# EAGLE schematic mainboard (EAGLE 4.13)
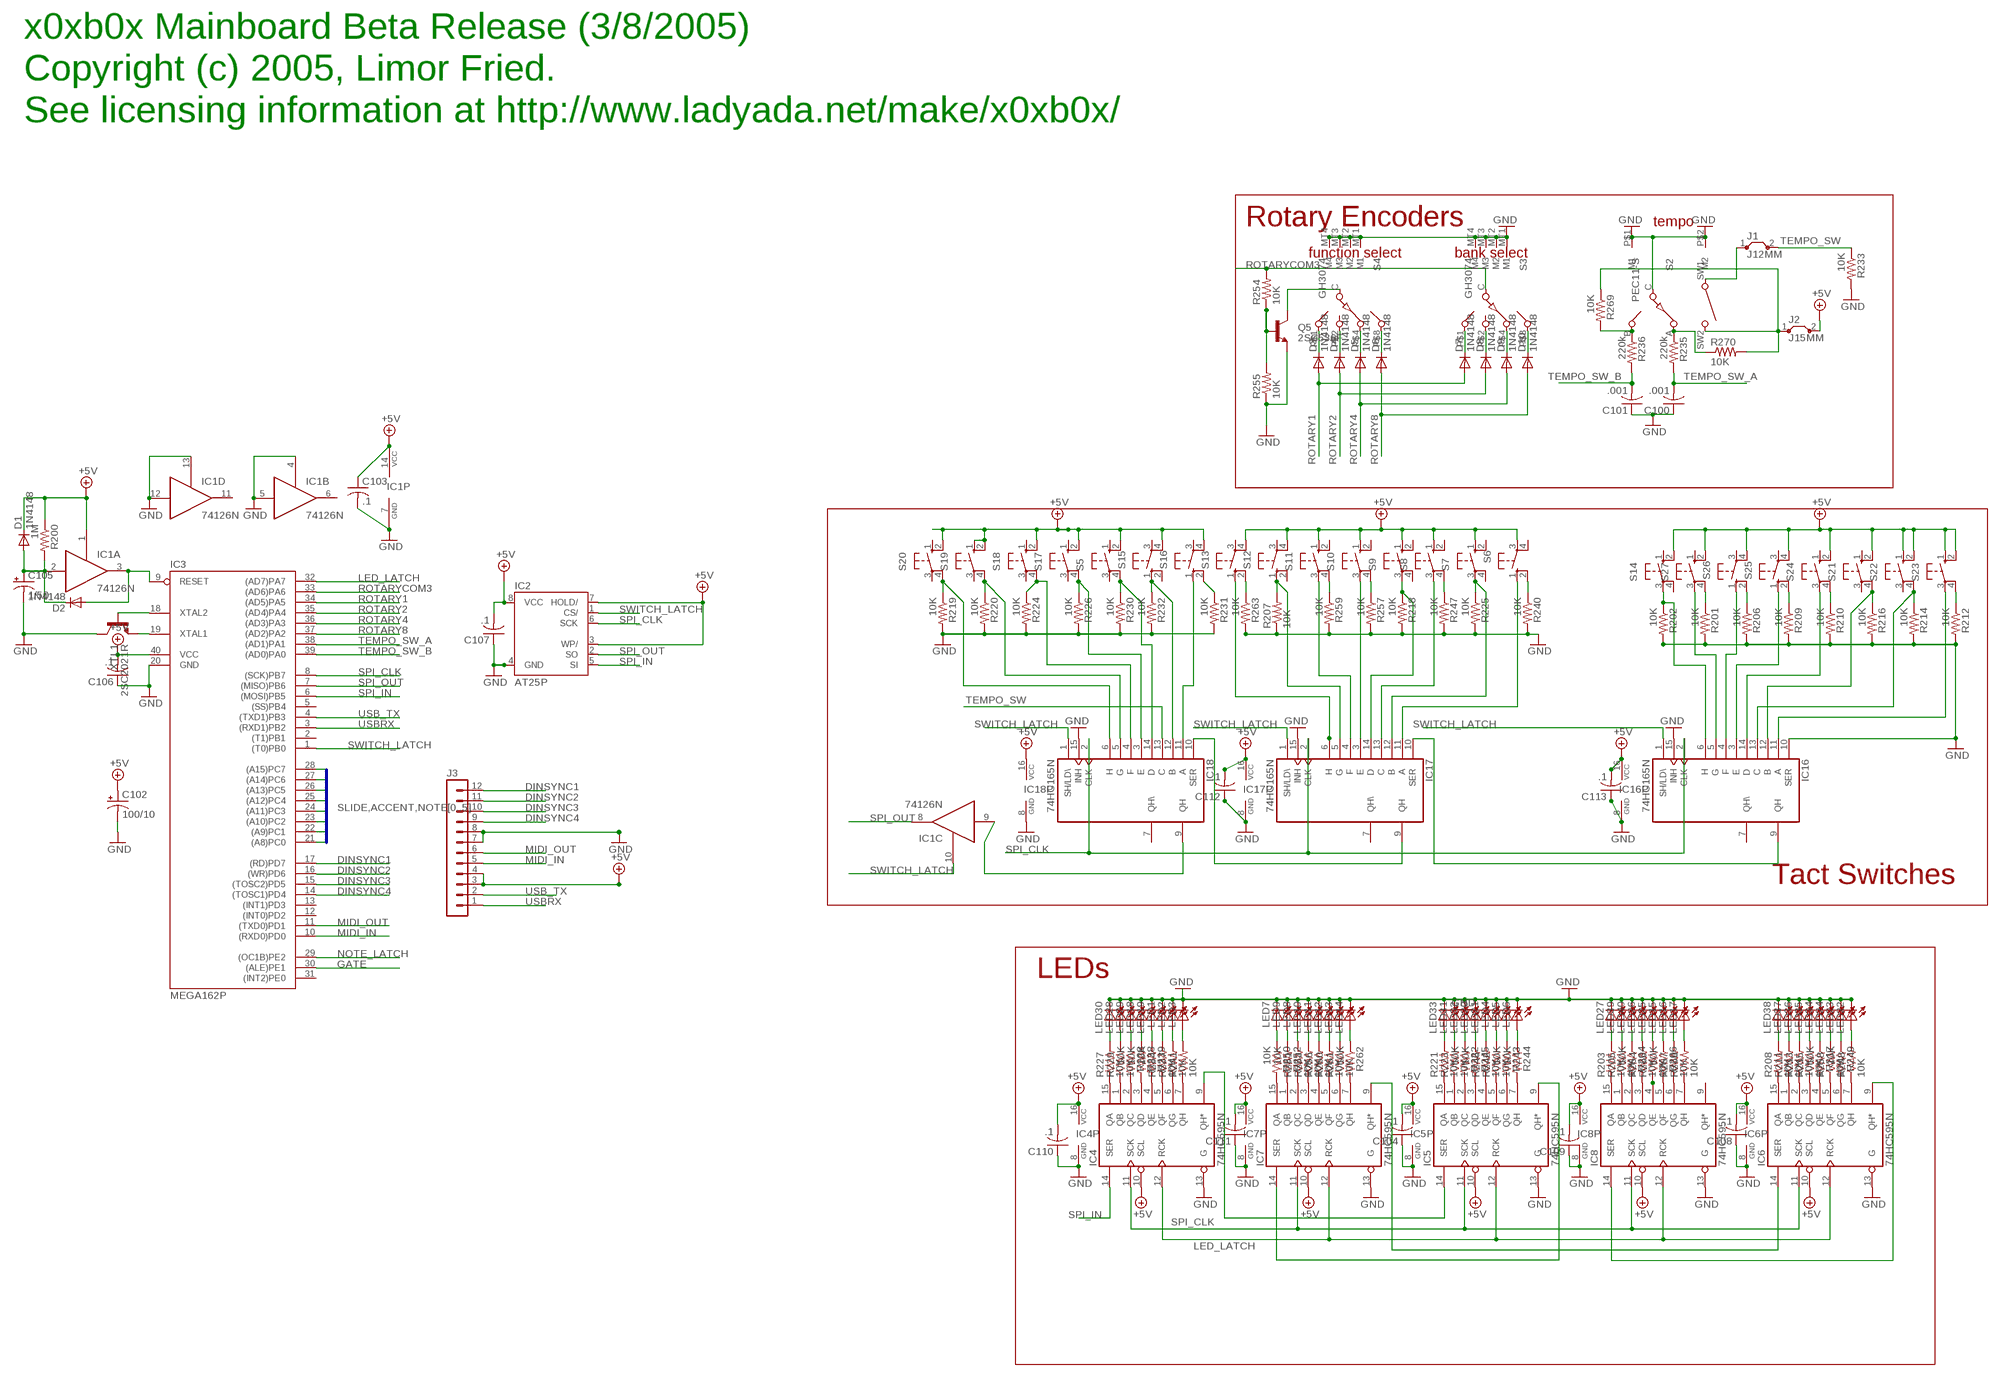
[diagram p0: schematic, sheet 1, part 1 of 2]
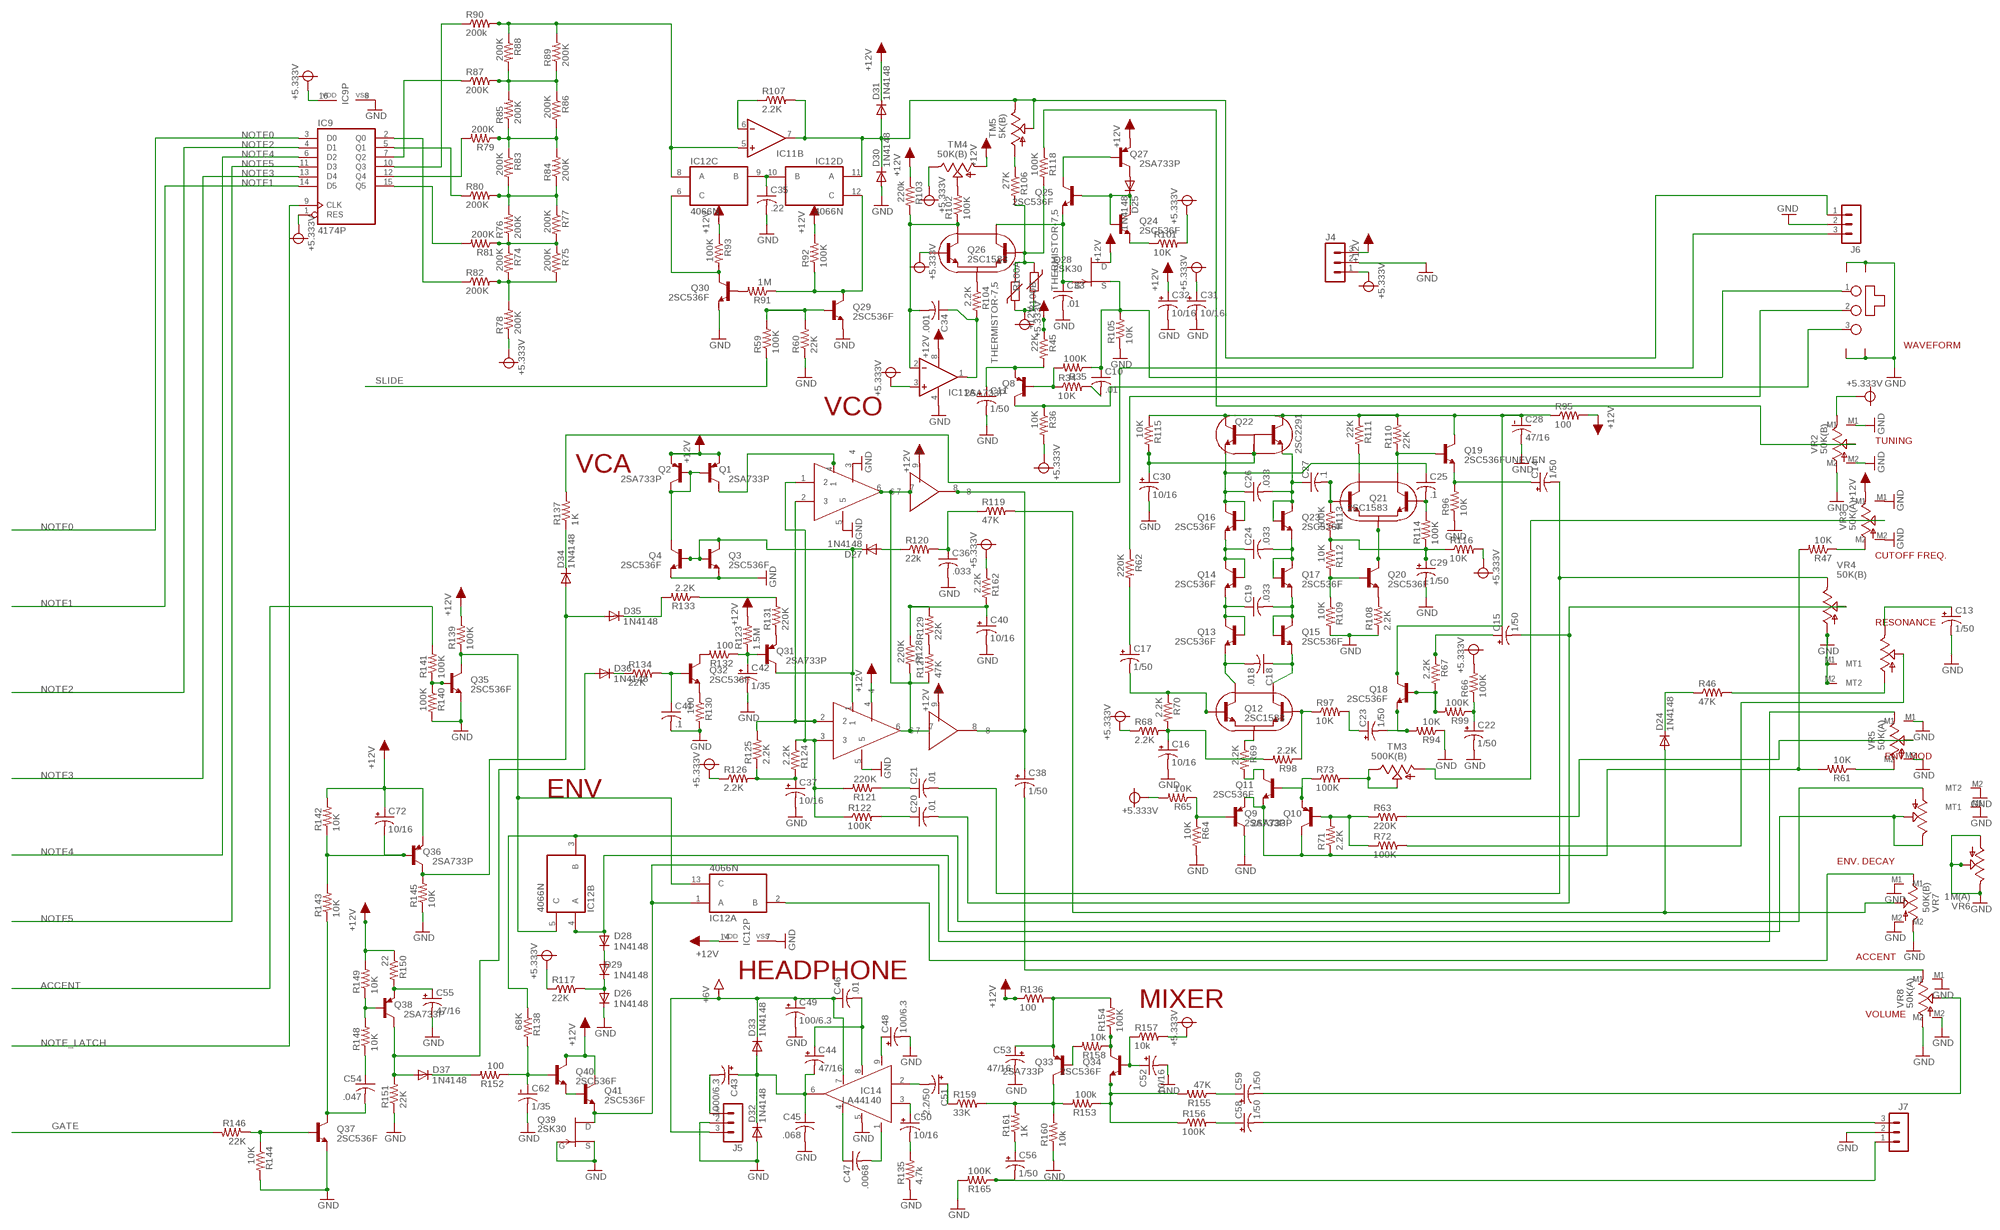
[diagram p1: schematic, sheet 1, part 2 of 2]

## Parts
C10  .01  C-US050-024X044  [C050-024X044]
C11  1/50  CPOL-USE5-6  [E5-6]
C13  1/50  CPOL-USE5-6  [E5-6]
C14  1/50  CPOL-USE5-6  [E5-6]
C15  1/50  CPOL-USE5-6  [E5-6]
C16  10/16  CPOL-USE5-6  [E5-6]
C17  1/50  CPOL-USE3.5-8  [E3,5-8]
C18  .018  C-US050-025X075  [C050-025X075]
C19  .033  C-US050-025X075  [C050-025X075]
C20  .01  C-US050-024X044  [C050-024X044]
C21  .01  C-US050-024X044  [C050-024X044]
C22  1/50  CPOL-USE5-6  [E5-6]
C23  1/50  CPOL-USE5-6  [E5-6]
C24  .033  C-US050-025X075  [C050-025X075]
C25  .1  C-US050-030X075  [C050-030X075]
C26  .033  C-US075-032X103  [C075-032X103]
C27  .1  C-US050-030X075  [C050-030X075]
C28  47/16  CPOL-USE5-6  [E5-6]
C29  1/50  CPOL-USE5-6  [E5-6]
C30  10/16  CPOL-USE5-6  [E5-6]
C31  10/16  CPOL-USE5-6  [E5-6]
C32  10/16  CPOL-USE5-6  [E5-6]
C33  .01  C-US050-024X044  [C050-024X044]
C34  .001  C-US050-035X075  [C050-035X075]
C35  .22  C-US050-045X075  [C050-045X075]
C36  .033  C-US050-025X075  [C050-025X075]
C37  10/16  CPOL-USE5-6  [E5-6]
C38  1/50  CPOL-USE5-6  [E5-6]
C40  10/16  CPOL-USE5-6  [E5-6]
C41  .1  C-US050-030X075  [C050-030X075]
C42  1/35  CPOL-USE2.5-7  [E2,5-7]
C43  1000/6.3  CPOL-USE5-5  [E5-5]
C44  47/16  CPOL-USE5-6  [E5-6]
C45  .068  C-US050-050X075  [C050-050X075]
C46  .01  C-US050-024X044  [C050-024X044]
C47  .0068  C-US050-075X075  [C050-075X075]
C48  100/6.3  CPOL-USE5-6  [E5-6]
C49  100/6.3  CPOL-USE5-6  [E5-6]
C50  10/16  CPOL-USE5-6  [E5-6]
C51  2.2/50  CPOL-USE5-6  [E5-6]
C52  10/16  CPOL-USE5-6  [E5-6]
C53  47/16  CPOL-USE5-6  [E5-6]
C54  .047  C-US050-055X075  [C050-055X075]
C55  47/16  CPOL-USE5-6  [E5-6]
C56  1/50  CPOL-USE5-6  [E5-6]
C58  1/50  CPOL-USE5-6  [E5-6]
C59  1/50  CPOL-USE5-6  [E5-6]
C62  1/35  CPOL-USE2.5-7  [E2,5-7]
C72  10/16  CPOL-USE5-6  [E5-6]
C100  .001  C-US050-035X075  [C050-035X075]
C101  .001  C-US050-035X075  [C050-035X075]
C102  100/10  CPOL-USE5-6  [E5-6]
C103  .1  C-US050H075X075  [C050H075X075]
C104  .1  C-US050H075X075  [C050H075X075]
C105  1/50  CPOL-USE5-6  [E5-6]
C106  .1  C-US050H075X075  [C050H075X075]
C107  .1  C-US050H075X075  [C050H075X075]
C108  .1  C-US050H075X075  [C050H075X075]
C109  .1  C-US050H075X075  [C050H075X075]
C110  .1  C-US050H075X075  [C050H075X075]
C111  .1  C-US050H075X075  [C050H075X075]
C112  .1  C-US050H075X075  [C050H075X075]
C113  .1  C-US050H075X075  [C050H075X075]
D1  1N4148  [DO35-10]
D2  1N4148  [DO35-10]
D3  1N4148  [DO35-10]
D4  1N4148  [DO35-10]
D5  1N4148  [DO35-10]
D6  1N4148  [DO35-10]
D7  1N4148  [DO35-10]
D8  1N4148  [DO35-10]
D9  1N4148  [DO35-10]
D10  1N4148  [DO35-10]
D24  1N4148  [DO35-10]
D25  1N4148  [DO35-10]
D26  1N4148  [DO35-10]
D27  1N4148  [DO35-10]
D28  1N4148  [DO35-10]
D29  1N4148  [DO35-10]
D30  1N4148  [DO35-10]
D31  1N4148  [DO35-10]
D32  1N4148  [DO35-10]
D33  1N4148  [DO35-10]
D34  1N4148  [DO35-10]
D35  1N4148  [DO35-10]
D36  1N4148  [DO35-10]
D37  1N4148  [DO35-10]
IC1  74126N  [DIL14]
IC2  AT25P  [DIL08]
IC3  MEGA162P  [DIL40]
IC4  74HC595N  [DIL16]
IC5  74HC595N  [DIL16]
IC6  74HC595N  [DIL16]
IC7  74HC595N  [DIL16]
IC8  74HC595N  [DIL16]
IC9  4174P  [DIL16]
IC11  AN6562N  [DIL08]
IC12  4066N  [DIL14]
IC14  LA44140  [SIP9]
IC15A  BA662  [SIP9]
IC15B  BA6110  [SIP9]
IC16  74HC165N  [DIL16]
IC17  74HC165N  [DIL16]
IC18  74HC165N  [DIL16]
J1  J12MM  [12]
J2  J15MM  [15]
J3  MA12-1  [MA12-1]
J4  MA03-1  [MA03-1]
J5  MA03-1  [MA03-1]
J6  MA03-1  [MA03-1]
J7  MA03-1  [MA03-1]
LED1  LED5MM  [LED5MM]
LED2  LED5MM  [LED5MM]
LED3  LED5MM  [LED5MM]
LED4  LED5MM  [LED5MM]
LED5  LED5MM  [LED5MM]
LED6  LED5MM  [LED5MM]
LED7  LED5MM  [LED5MM]
LED8  LED5MM  [LED5MM]
LED9  LED5MM  [LED5MM]
LED10  LED5MM  [LED5MM]
LED11  LED5MM  [LED5MM]
LED12  LED5MM  [LED5MM]
LED13  LED5MM  [LED5MM]
LED14  LED5MM  [LED5MM]
LED15  LED5MM  [LED5MM]
LED16  LED5MM  [LED5MM]
LED17  LED5MM  [LED5MM]
LED18  LED5MM  [LED5MM]
LED19  LED5MM  [LED5MM]
LED20  LED5MM  [LED5MM]
LED21  LED5MM  [LED5MM]
LED22  LED5MM  [LED5MM]
LED23  LED5MM  [LED5MM]
LED24  LED5MM  [LED5MM]
LED25  LED5MM  [LED5MM]
LED26  LED5MM  [LED5MM]
LED27  LED5MM  [LED5MM]
LED28  LED5MM  [LED5MM]
LED29  LED5MM  [LED5MM]
LED30  LED5MM  [LED5MM]
LED31  LED5MM  [LED5MM]
LED32  LED5MM  [LED5MM]
LED33  LED5MM  [LED5MM]
LED34  LED5MM  [LED5MM]
LED35  LED5MM  [LED5MM]
LED36  LED5MM  [LED5MM]
LED37  LED5MM  [LED5MM]
LED38  LED5MM  [LED5MM]
LED39  LED5MM  [LED5MM]
LED40  LED5MM  [LED5MM]
Q1  2SA733P  [TO92]
Q2  2SA733P  [TO92]
Q3  2SC536F  [2SC536F]
Q4  2SC536F  [2SC536F]
Q5  2SC536F  [2SC536F]
Q8  2SA733P  [TO92]
Q9  2SA733P  [TO92]
Q10  2SA733P  [TO92]
Q11  2SC536F  [2SC536F]
Q12  2SC1583  [SSIP5]
Q13  2SC536F  [2SC536F]
Q14  2SC536F  [2SC536F]
Q15  2SC536F  [2SC536F]
Q16  2SC536F  [2SC536F]
Q17  2SC536F  2SC536FUNEVEN  [2SC536_UNEVEN]
Q18  2SC536F  [2SC536F]
Q19  2SC536FUNEVEN  [2SC536_UNEVEN]
Q20  2SC536F  [2SC536F]
Q21  2SC1583  [SSIP5]
Q22  2SC2291  [SSIP5]
Q23  2SC536F  2SC536FUNEVEN  [2SC536_UNEVEN]
Q24  2SC536F  [2SC536F]
Q25  2SC536F  [2SC536F]
Q26  2SC1583  [SSIP5]
Q27  2SA733P  [TO92]
Q28  2SK30  [2SK30]
Q29  2SC536F  [2SC536F]
Q30  2SC536F  [2SC536F]
Q31  2SA733P  [TO92]
Q32  2SC536F  [2SC536F]
Q33  2SA733P  [TO92]
Q34  2SC536F  [2SC536F]
Q35  2SC536F  [2SC536F]
Q36  2SA733P  [TO92]
Q37  2SC536F  [2SC536F]
Q38  2SA733P  [TO92]
Q39  2SK30  [2SK30]
Q40  2SC536F  [2SC536F]
Q41  2SC536F  [2SC536F]
R34  10K  R-US_0207/5V  [0207/5V]
R35  100K  R-US_0207/5V  [0207/5V]
R36  10K  R-US_0207/5V  [0207/5V]
R45  22K  R-US_0207/5V  [0207/5V]
R46  47K  R-US_0207/5V  [0207/5V]
R47  10K  R-US_0207/5V  [0207/5V]
R59  100K  R-US_0207/5V  [0207/5V]
R60  22K  R-US_0207/5V  [0207/5V]
R61  10K  R-US_0207/5V  [0207/5V]
R62  220K  R-US_0207/5V  [0207/5V]
R63  220K  R-US_0207/5V  [0207/5V]
R64  10K  R-US_0207/5V  [0207/5V]
R65  10K  R-US_0207/5V  [0207/5V]
R66  100K  R-US_0207/5V  [0207/5V]
R67  2.2K  R-US_0207/5V  [0207/5V]
R68  2.2K  R-US_0207/5V  [0207/5V]
R69  2.2K  R-US_0207/5V  [0207/5V]
R70  2.2K  R-US_0207/5V  [0207/5V]
R71  2.2K  R-US_0207/5V  [0207/5V]
R72  100K  R-US_0207/5V  [0207/5V]
R73  100K  R-US_0207/5V  [0207/5V]
R74  200K  R-US_0207/5V  [0207/5V]
R75  200K  R-US_0207/5V  [0207/5V]
R76  200K  R-US_0207/5V  [0207/5V]
R77  200K  R-US_0207/5V  [0207/5V]
R78  200K  R-US_0207/5V  [0207/5V]
R79  200K  R-US_0207/5V  [0207/5V]
R80  200K  R-US_0207/5V  [0207/5V]
R81  200K  R-US_0207/5V  [0207/5V]
R82  200K  R-US_0207/5V  [0207/5V]
R83  200K  R-US_0207/5V  [0207/5V]
R84  200K  R-US_0207/5V  [0207/5V]
R85  200K  R-US_0207/5V  [0207/5V]
R86  200K  R-US_0207/5V  [0207/5V]
R87  200K  R-US_0207/5V  [0207/5V]
R88  200K  R-US_0207/5V  [0207/5V]
R89  200K  R-US_0207/5V  [0207/5V]
R90  200k  R-US_0207/5V  [0207/5V]
R91  1M  R-US_0207/5V  [0207/5V]
R92  100K  R-US_0207/5V  [0207/5V]
R93  100K  R-US_0207/5V  [0207/5V]
R94  10K  R-US_0207/5V  [0207/5V]
R95  100  R-US_0207/5V  [0207/5V]
R96  10K  R-US_0207/2V  [0207/2V]
R97  10K  R-US_0207/2V  [0207/2V]
R98  2.2K  R-US_0207/2V  [0207/2V]
R99  100K  R-US_0207/5V  [0207/5V]
R100A  THERMISTOR-7,5  [R-7,5]
R100B  THERMISTOR-7,5  [R-7,5]
R101  10K  R-US_0207/5V  [0207/5V]
R102  100K  R-US_0207/5V  [0207/5V]
R103  220k  R-US_0207/5V  [0207/5V]
R104  2.2K  R-US_0207/5V  [0207/5V]
R105  10K  R-US_0207/5V  [0207/5V]
R106  27K  R-US_0207/5V  [0207/5V]
R107  2.2K  R-US_0207/5V  [0207/5V]
R108  2.2K  R-US_0207/5V  [0207/5V]
R109  10K  R-US_0207/5V  [0207/5V]
R110  22K  R-US_0207/5V  [0207/5V]
R111  22K  R-US_0207/5V  [0207/5V]
R112  10K  R-US_0207/5V  [0207/5V]
R113  100K  R-US_0207/5V  [0207/5V]
R114  100K  R-US_0207/5V  [0207/5V]
R115  10K  R-US_0207/2V  [0207/2V]
R116  10K  R-US_0207/5V  [0207/5V]
R117  22K  R-US_0207/5V  [0207/5V]
R118  100K  R-US_0207/5V  [0207/5V]
R119  47K  R-US_0207/5V  [0207/5V]
R120  22k  R-US_0207/5V  [0207/5V]
R121  220K  R-US_0207/5V  [0207/5V]
R122  100K  R-US_0207/5V  [0207/5V]
R123  1.5M  R-US_0207/5V  [0207/5V]
R124  2.2K  R-US_0207/5V  [0207/5V]
R125  2.2K  R-US_0207/5V  [0207/5V]
R126  2.2K  R-US_0207/5V  [0207/5V]
R127  47K  R-US_0207/5V  [0207/5V]
R128  220K  R-US_0207/5V  [0207/5V]
R129  22K  R-US_0207/5V  [0207/5V]
R130  100  R-US_0207/5V  [0207/5V]
R131  220K  R-US_0207/5V  [0207/5V]
R132  100  R-US_0207/5V  [0207/5V]
R133  2.2K  R-US_0207/5V  [0207/5V]
R134  22K  R-US_0207/5V  [0207/5V]
R135  4.7k  R-US_0207/5V  [0207/5V]
R136  100  R-US_0207/5V  [0207/5V]
R137  1K  R-US_0207/10  [0207/10]
R138  68K  R-US_0207/5V  [0207/5V]
R139  100K  R-US_0207/5V  [0207/5V]
R140  100K  R-US_0207/5V  [0207/5V]
R141  100K  R-US_0207/5V  [0207/5V]
R142  10K  R-US_0207/5V  [0207/5V]
R143  10K  R-US_0207/5V  [0207/5V]
R144  10K  R-US_0207/5V  [0207/5V]
R145  10K  R-US_0207/5V  [0207/5V]
R146  22K  R-US_0207/5V  [0207/5V]
R148  10K  R-US_0207/5V  [0207/5V]
R149  10K  R-US_0207/5V  [0207/5V]
R150  22  R-US_0207/5V  [0207/5V]
R151  22K  R-US_0207/5V  [0207/5V]
R152  100  R-US_0207/5V  [0207/5V]
R153  100k  R-US_0207/5V  [0207/5V]
R154  100K  R-US_0207/5V  [0207/5V]
R155  47K  R-US_0207/5V  [0207/5V]
R156  100K  R-US_0207/5V  [0207/5V]
R157  10k  R-US_0207/5V  [0207/5V]
R158  10k  R-US_0207/5V  [0207/5V]
R159  33K  R-US_0207/5V  [0207/5V]
R160  10k  R-US_0207/5V  [0207/5V]
R161  1K  R-US_0207/5V  [0207/5V]
R162  2.2K  R-US_0207/5V  [0207/5V]
R165  100K  R-US_0207/5V  [0207/5V]
R200  1M  R-US_0207/5V  [0207/5V]
R201  10K  R-US_0207/5V  [0207/5V]
R202  10K  R-US_0207/5V  [0207/5V]
R203  10K  R-US_0207/5V  [0207/5V]
R204  10K  R-US_0207/5V  [0207/5V]
R205  10K  R-US_0207/5V  [0207/5V]
R206  10K  R-US_0207/5V  [0207/5V]
R207  10K  R-US_0207/5V  [0207/5V]
R208  10K  R-US_0207/5V  [0207/5V]
R209  10K  R-US_0207/5V  [0207/5V]
R210  10K  R-US_0207/5V  [0207/5V]
R211  10K  R-US_0207/5V  [0207/5V]
R212  10K  R-US_0207/5V  [0207/5V]
R213  10K  R-US_0207/5V  [0207/5V]
R214  10K  R-US_0207/5V  [0207/5V]
R215  10K  R-US_0207/5V  [0207/5V]
R216  10K  R-US_0207/5V  [0207/5V]
R217  10K  R-US_0207/5V  [0207/5V]
R218  10K  R-US_0207/5V  [0207/5V]
R219  10K  R-US_0207/5V  [0207/5V]
R220  10K  R-US_0207/5V  [0207/5V]
R221  10K  R-US_0207/5V  [0207/5V]
R222  10K  R-US_0207/5V  [0207/5V]
R223  10K  R-US_0207/5V  [0207/5V]
R224  10K  R-US_0207/5V  [0207/5V]
R225  10K  R-US_0207/5V  [0207/5V]
R226  10K  R-US_0207/5V  [0207/5V]
R227  10K  R-US_0207/5V  [0207/5V]
R228  10K  R-US_0207/5V  [0207/5V]
R229  10K  R-US_0207/5V  [0207/5V]
R230  10K  R-US_0207/5V  [0207/5V]
R231  10K  R-US_0207/5V  [0207/5V]
R232  10K  R-US_0207/10  [0207/10]
R233  10K  R-US_0207/5V  [0207/5V]
R234  10K  R-US_0207/15  [0207/15]
R235  220k  R-US_0207/5V  [0207/5V]
R236  220k  R-US_0207/5V  [0207/5V]
R237  10K  R-US_0207/5V  [0207/5V]
R238  10K  R-US_0207/5V  [0207/5V]
R239  10K  R-US_0207/5V  [0207/5V]
R240  10K  R-US_0207/5V  [0207/5V]
R241  10K  R-US_0207/5V  [0207/5V]
R242  10K  R-US_0207/5V  [0207/5V]
R243  10K  R-US_0207/5V  [0207/5V]
R244  10K  R-US_0207/5V  [0207/5V]
R245  10K  R-US_0207/5V  [0207/5V]
R246  10K  R-US_0207/5V  [0207/5V]
R247  10K  R-US_0207/5V  [0207/5V]
R248  10K  R-US_0207/5V  [0207/5V]
R249  10K  R-US_0207/5V  [0207/5V]
R250  10K  R-US_0207/5V  [0207/5V]
R251  10K  R-US_0207/5V  [0207/5V]
R252  10K  R-US_0207/5V  [0207/5V]
R253  10K  R-US_0207/5V  [0207/5V]
R254  10K  R-US_0207/5V  [0207/5V]
R255  10K  R-US_0207/5V  [0207/5V]
R256  10K  R-US_0207/5V  [0207/5V]
R257  10K  R-US_0207/5V  [0207/5V]
R258  10K  R-US_0207/5V  [0207/5V]
R259  10K  R-US_0207/5V  [0207/5V]
R260  10K  R-US_0207/5V  [0207/5V]
R261  10K  R-US_0207/5V  [0207/5V]
R262  10K  R-US_0207/5V  [0207/5V]
R263  10K  R-US_0207/5V  [0207/5V]
R264  10K  R-US_0207/5V  [0207/5V]
R265  10K  R-US_0207/5V  [0207/5V]
R266  10K  R-US_0207/5V  [0207/5V]
R267  10K  R-US_0207/5V  [0207/5V]
R268  10K  R-US_0207/5V  [0207/5V]
R269  10K  R-US_0207/5V  [0207/5V]
R270  10K  R-US_0207/5V  [0207/5V]
S1  SWITCH_GND  [NKKTOGGLE]
S2  PEC11-S  [PEC11-S]
S3  GH3074  [GH3074]
S4  GH3074  [GH3074]
S5  40-XX  [B3F-40XX]
S6  40-XX  [B3F-40XX]
S7  40-XX  [B3F-40XX]
S8  40-XX  [B3F-40XX]
S9  40-XX  [B3F-40XX]
S10  40-XX  [B3F-40XX]
S11  40-XX  [B3F-40XX]
S12  40-XX  [B3F-40XX]
S13  40-XX  [B3F-40XX]
S14  40-XX  [B3F-40XX]
S15  40-XX  [B3F-40XX]
S16  40-XX  [B3F-40XX]
S17  40-XX  [B3F-40XX]
S18  40-XX  [B3F-40XX]
S19  40-XX  [B3F-40XX]
S20  40-XX  [B3F-40XX]
S21  40-XX  [B3F-40XX]
S22  40-XX  [B3F-40XX]
S23  40-XX  [B3F-40XX]
S24  40-XX  [B3F-40XX]
S25  40-XX  [B3F-40XX]
S26  40-XX  [B3F-40XX]
S27  40-XX  [B3F-40XX]
TM3  500K(B)  TRIM_US-  [306]
TM4  50K(B)  TRIM_US-  [306]
TM5  5K(B)  TRIM_US-  [306]
VR2  50K(B)  POTEVU  [EVU]
VR3  50K(A)  POTEVU  [EVU]
VR4  50K(B)  DUALALPHA  [ALPHADUAL]
VR5  50K(A)  POTEVU  [EVU]
VR6  1M(A)  DUALALPHA  [ALPHADUAL]
VR7  50K(B)  POTEVU  [EVU]
VR8  50K(A)  POTEVU  [EVU]
XTL1  2SC2021R  [2SC2021]

## Nets
+5.333V: C31.+ IC9.1(RES) IC9.16(VDD) IC11.3(A:+IN) J4.1 Q26.1(B) R36.2 R65.2 R66.2 R68.1 R78.1 R100A.2 R100B.1 R101.2 R116.2 R117.1 R126.1 R157.2 R162.1 TM4.3(E) VR2.3(E)
+5V: C102.+ C103.1 C104.2 C106.2 C107.2 C108.2 C109.2 C110.2 C111.2 C112.2 C113.2 D1.C IC1.1(A:OE) IC1.14(P:VCC) IC2.3(WP/) IC2.7(HOLD/) IC2.8(VCC) IC3.40(VCC) IC4.10(SCL) IC4.16(VCC) IC5.10(SCL) IC5.16(VCC) IC6.10(SCL) IC6.16(VCC) IC7.10(SCL) IC7.16(VCC) IC8.10(SCL) IC8.16(VCC) IC16.16(VCC) IC17.16(VCC) IC18.16(VCC) J2.2 J3.3 J3.4 R200.1 S5.2(S1) S6.3(P) S7.1(S) S8.1(S) S9.1(S) S10.1(S) S11.1(S) S12.4(P1) S13.4(P1) S14.2(S1) S15.4(P1) S16.4(P1) S17.2(S1) S18.2(S1) S19.1(S) S19.2(S1) S20.2(S1) S21.2(S1) S22.1(S) S22.2(S1) S23.1(S) S23.2(S1) S24.2(S1) S25.4(P1) S26.4(P1) S27.2(S1)
+6V: C46.1 C49.+ D33.C IC14.7 J5.3
+12V: C32.+ C72.+ D31.C IC11.8(P:V+) IC12.14(P:VDD) IC15A.4 IC15A.9 IC15B.9 J4.3 Q1.3(E) Q2.3(E) Q27.3(E) Q28.1(D) Q36.3(E) Q40.2(C) Q41.2(C) R45.1 R92.2 R93.1 R95.2 R103.1 R123.2 R136.1 R139.2 R142.2 R149.2 R150.1 TM4.1(A) VR3.3(E)
ACCENT: IC3.28((A15)PC7) R141.2
C48: C48.+ IC14.9
DINSYNC1: IC3.17((RD)PD7) J3.12
DINSYNC2: IC3.16((WR)PD6) J3.11
DINSYNC3: IC3.15((TOSC2)PD5) J3.10
DINSYNC4: IC3.14((TOSC1)PD4) J3.9
GATE: IC3.30((ALE)PE1) R146.2
GND: C11.- C13.- C16.- C22.- C28.- C29.- C30.- C31.- C32.- C33.2 C35.2 C36.2 C37.- C40.- C41.2 C42.- C45.2 C48.- C49.- C52.- C53.- C55.- C62.- C100.1 C101.1 C102.- C103.2 C104.1 C105.- C106.1 C107.1 C108.1 C109.1 C110.1 C111.1 C112.1 C113.1 D26.C D30.A D32.A IC1.4(B:OE) IC1.5(B:I) IC1.7(P:GND) IC1.12(D:I) IC1.13(D:OE) IC2.4(GND) IC3.20(GND) IC4.8(GND) IC4.13(G) IC5.8(GND) IC5.13(G) IC6.8(GND) IC6.13(G) IC7.8(GND) IC7.13(G) IC8.8(GND) IC8.13(G) IC9.8(VSS) IC11.4(P:V-) IC12.7(P:VSS) IC14.5 IC15A.5 IC15B.3 IC15B.5 IC16.8(GND) IC16.10(SER) IC16.15(INH) IC17.8(GND) IC17.15(INH) IC18.8(GND) IC18.15(INH) J3.7 J3.8 J4.2 J5.2 J6.2 J7.2 LED1.K(C) LED2.K(C) LED3.K(C) LED4.K(C) LED5.K(C) LED6.K(C) LED7.K(C) LED8.K(C) LED9.K(C) LED10.K(C) LED11.K(C) LED12.K(C) LED13.K(C) LED14.K(C) LED15.K(C) LED16.K(C) LED17.K(C) LED18.K(C) LED19.K(C) LED20.K(C) LED21.K(C) LED22.K(C) LED23.K(C) LED24.K(C) LED25.K(C) LED26.K(C) LED27.K(C) LED28.K(C) LED29.K(C) LED30.K(C) LED31.K(C) LED32.K(C) LED33.K(C) LED34.K(C) LED35.K(C) LED36.K(C) LED37.K(C) LED38.K(C) LED39.K(C) LED40.K(C) Q3.3(E) Q4.3(E) Q5.3(E) Q9.2(C) Q29.3(E) Q30.3(E) Q35.3(E) Q37.3(E) Q39.2(G) Q39.3(S) R60.1 R64.2 R94.1 R96.1 R105.1 R108.1 R109.2 R130.2 R135.1 R140.2 R144.2 R145.1 R151.1 R160.1 R165.2 R201.2 R202.2 R206.2 R207.1 R209.2 R210.2 R212.2 R214.2 R216.2 R218.2 R219.2 R220.2 R224.2 R225.2 R226.2 R230.2 R231.2 R232.2 R233.2 R240.2 R247.2 R255.1 R257.2 R259.2 R263.2 S1.M1 S1.M2 S1.M3 S1.M4 S2.C S2.P$1(M1) S2.P$2(M2) S3.MT1(M1) S3.MT2(M2) S3.MT3(M3) S3.MT4(M4) S4.MT1(M1) S4.MT2(M2) S4.MT3(M3) S4.MT4(M4) VR2.1(A) VR2.M1 VR2.M2 VR3.M1 VR3.M2 VR4.1A(A) VR4.M1(MT1) VR4.M2(MT2) VR5.M1 VR5.M2 VR6.1A(A) VR6.2A(S) VR6.3A(E) VR6.M1(MT1) VR6.M2(MT2) VR7.1(A) VR7.M1 VR7.M2 VR8.1(A) VR8.M1 VR8.M2 XTL1.2(C)
LED_LATCH: IC3.32((AD7)PA7) IC4.12(RCK) IC5.12(RCK) IC6.12(RCK) IC7.12(RCK) IC8.12(RCK)
MIDI_IN: IC3.10((RXD0)PD0) J3.5
MIDI_OUT: IC3.11((TXD0)PD1) J3.6
N$1: C51.- IC14.2
N$2: C51.+ R159.1
N$3: C50.+ IC14.3
N$4: C50.- R135.2
N$5: Q34.3(E) R153.1 R155.2 R156.1
N$6: C56.+ R161.1
N$7: C56.- J7.1 R165.1
N$8: C47.1 IC14.4
N$9: C47.2 IC14.1
N$10: C43.- J5.1
N$11: C43.+ C44.- C45.1 D32.C D33.A IC14.6
N$12: Q33.2(C) R153.2 R159.2 R160.2 R161.2
N$13: C44.+ C46.2 IC14.8
N$14: Q34.2(C) R154.1 R158.1
N$15: Q33.1(B) R158.2
N$16: C53.+ Q33.3(E) R136.2 R154.2
N$17: C52.+ Q34.1(B) R157.1
N$18: C59.+ R155.1
N$19: C58.+ R156.2
N$20: C58.- J7.3
N$21: C20.1 R122.2
N$22: C37.+ R124.2 R125.1 R126.2
N$23: IC7.1(QB) R252.2
N$24: IC15A.2 IC15B.2 R125.2
N$25: C21.1 R121.1
N$26: C15.- C20.2 VR4.2A(S)
N$27: C14.- C21.2 VR4.3A(E)
N$28: IC15A.6 IC15A.7 IC15B.6 IC15B.7 R127.1 R128.2
N$29: IC15B.4 Q1.2(C)
N$30: R127.2 R129.1
N$31: C40.+ R128.1 R129.2 R162.2
N$32: C38.- VR8.3(E)
N$33: D27.A R120.1
N$34: C36.1 R119.1 R120.2
N$35: D24.A R119.2 VR7.2(S)
N$36: C55.+ Q38.3(E) R150.2
N$37: C72.- Q36.1(B) R142.1 R143.2
N$39: D34.A D35.A Q36.2(C) R145.2
N$40: Q38.1(B) R148.2 R149.1
N$41: D37.C R152.2
N$42: C54.1 R148.1
N$43: C54.2 Q37.2(C) R143.1
N$44: Q37.1(B) R144.1 R146.1
N$45: D36.A D37.A Q38.2(C) R151.2
N$46: C62.+ Q40.1(B) R138.2 R152.1
N$47: Q40.3(E) Q41.1(B)
N$48: C38.+ IC15A.8 IC15B.8
N$49: R61.1 VR5.1(A)
N$50: D26.A D29.C R117.2
N$51: D28.C D29.A
N$52: D28.A IC12.4(B:A) VR6.2B(S1) VR6.3B(E1)
N$53: IC12.1(A:A) Q39.1(D) Q41.3(E) VR5.3(E)
N$55: Q35.1(B) R140.1 R141.1
N$56: Q32.3(E) R130.1
N$57: IC12.5(B:C) IC12.13(A:C) Q35.2(C) R139.1
N$58: D34.C R137.1
N$59: Q5.1(B) R254.1 R255.2
N$60: Q12.5(B1) R97.1 R98.1
N$63: D35.C R133.2
N$64: D36.C R134.1
N$65: C41.1 Q32.1(B) R134.2
N$67: Q32.2(C) R132.2
N$68: C42.+ Q31.1(B) R123.1 R132.1
N$69: D27.C IC15A.1 Q3.1(B) Q3.2(C) Q4.1(B) Q31.2(C)
N$70: Q31.3(E) R131.1
N$71: R131.2 R133.1
N$77: IC9.10(Q3) R90.1
N$78: R236.1 R269.2 S2.B
N$81: IC4.7(QH) R241.1
N$82: C35.1 IC12.9(C:B) IC12.10(D:B)
N$83: IC12.6(C:C) Q30.2(C) R93.2
N$84: Q30.1(B) R91.2
N$85: IC11.6(B:-IN) R107.1
N$86: R85.2 R86.1 R87.2 R88.2 R89.1
N$87: IC1.9(C:I) IC18.9(QH)
N$88: IC12.12(D:C) Q29.2(C) R91.1 R92.1
N$89: R79.1 R83.1 R84.2 R85.1 R86.2
N$90: C105.+ D1.A D2.C IC1.2(A:I) R200.2
N$91: IC9.15(Q5) R81.2
N$92: IC9.2(Q0) R82.1
N$93: IC9.12(Q4) R79.2
N$95: Q29.1(B) R59.2 R60.2
N$97: C34.1 IC11.1(A:OUT) R104.2
N$98: C34.2 IC11.2(A:-IN) Q26.2(C) R102.1 R103.2
N$99: Q26.5(B1) R100A.1 R100B.2 R106.2 R118.2
N$100: IC4.6(QG) R237.1
N$101: Q26.3(E) R104.1
N$102: R118.1 VR2.2(S)
N$103: D25.A Q27.2(C)
N$104: D25.C Q24.1(B) Q24.2(C) Q25.1(B)
N$105: Q24.3(E) R101.1
N$106: Q25.2(C) Q27.1(B)
N$107: IC17.5(G) R207.2 S12.1(S)
N$108: C10.1 Q28.3(S) R35.1 R105.2 S1.1
N$109: Q8.1(B) R34.1 R35.2
N$110: C10.2 R34.2
N$112: IC11.5(B:+IN) IC12.8(C:A) R88.1 R89.2 R90.2
N$113: C33.1 Q25.3(E) Q26.4(C1) Q28.2(G)
N$114: R102.2 TM4.2(S)
N$115: C30.+ Q22.3(B) R115.2
N$116: C24.1 Q14.1(B) Q14.2(C) Q16.3(E)
N$117: C19.1 Q13.1(B) Q13.2(C) Q14.3(E)
N$118: C18.2 Q12.2(C) Q13.3(E)
N$119: C24.2 Q17.1(B) Q17.2(C) Q23.3(E)
N$120: C26.2 C27.1 Q22.5(E) Q23.1(B) Q23.2(C)
N$121: C18.1 Q12.4(C1) Q15.3(E)
N$122: C28.+ Q18.2(C) Q19.2(C) Q22.2(C1) Q22.4(C) R95.1 R110.2 R111.1 R115.1
N$123: C17.+ R62.2
N$124: C17.- Q12.1(B) R70.1
N$125: C16.+ R68.2 R70.2 R98.2
N$126: R62.1 S1.2
N$127: Q12.3(E) R69.1
N$128: C23.+ R97.2
N$129: LED6.A R244.1
N$130: C23.- Q18.3(E) R94.2
N$131: Q18.1(B) R67.2 R99.2
N$132: C22.+ R66.1 R99.1
N$133: C15.+ R67.1
N$134: Q10.1(B) R63.1 R71.2 R72.1
N$135: Q20.1(B) R109.1 R112.2
N$136: Q20.3(E) R108.2
N$137: LED7.A R250.1
N$138: C25.2 Q21.1(B) R114.2
N$139: Q20.2(C) Q21.3(E)
N$140: Q19.1(B) Q21.2(C) R110.1
N$141: C27.2 Q21.5(B1) R113.1
N$142: R47.1 VR3.1(A)
N$143: C25.1 C26.1 Q16.1(B) Q16.2(C) Q22.1(E1)
N$144: C14.+ Q19.3(E) R96.2
N$146: Q11.2(C) R69.2
N$147: Q10.3(E) Q11.1(B) R73.1
N$148: Q21.4(C1) R111.2
N$149: Q9.1(B) R64.1 R65.1
N$150: IC12.2(A:B) VR7.3(E)
N$151: R73.2 TM3.2(S) TM3.3(E)
N$152: R72.2 VR4.2B(S1)
N$153: R63.2 VR5.2(S)
N$154: TM3.1(A) VR3.2(S)
N$155: R76.2 R77.1 R80.2 R83.2 R84.1
N$156: IC12.3(B:B) R138.1 VR6.1B(A1)
N$157: R106.1 TM5.1(A)
N$158: C59.- VR8.2(S)
N$159: D24.C R46.1
N$160: R46.2 VR4.1B(A1)
N$161: C13.+ VR4.3B(E1)
N$162: R257.1 S10.4(P1)
N$163: IC17.14(D) R218.1 S9.3(P)
N$164: IC17.13(C) S8.3(P)
N$165: IC17.12(B) R225.1 S7.3(P)
N$166: R259.1 S11.4(P1)
N$167: IC18.14(D) R230.1 S5.4(P1)
N$168: D3.C S4.P$1
N$169: IC18.12(B) R232.1 S15.1(S)
N$170: R206.1 S26.2(S1)
N$171: IC16.5(G) S27.3(P)
N$172: IC17.9(QH) IC18.10(SER)
N$173: IC18.4(F) R224.1 S18.4(P1)
N$174: IC17.4(F) S11.3(P)
N$175: D4.C S4.P$2
N$176: R209.1 S25.2(S1)
N$177: IC4.5(QF) R234.1
N$181: IC5.9(QH*) IC7.14(SER)
N$182: IC5.6(QG) R243.2
N$183: IC5.7(QH) R244.2
N$184: IC5.5(QF) R242.1
N$185: IC7.15(QA) R250.2
N$186: IC7.2(QC) R251.1
N$187: LED1.A R234.2
N$188: LED2.A R237.2
N$189: IC7.3(QD) R253.1
N$190: IC7.4(QE) R256.1
N$191: LED14.A R262.1
N$192: IC8.3(QD) R264.1
N$193: IC8.6(QG) R267.1
N$194: IC8.7(QH) R268.1
N$195: IC8.5(QF) R266.2
N$196: IC5.1(QB) R223.1
N$197: IC8.4(QE) R265.1
N$198: IC5.2(QC) R222.2
N$199: IC5.15(QA) R221.1
N$200: IC5.4(QE) R246.1
N$201: IC5.3(QD) R245.2
N$202: IC4.3(QD) R238.2
N$203: IC4.4(QE) R239.2
N$204: IC4.1(QB) R229.1
N$205: IC7.6(QG) R261.1
N$206: IC7.7(QH) R262.2
N$207: IC7.5(QF) R260.1
N$208: IC4.2(QC) R228.2
N$209: IC4.15(QA) R227.1
N$210: IC8.15(QA) R203.1
N$211: IC8.1(QB) R205.1
N$212: IC8.2(QC) R204.2
N$213: IC6.15(QA) R208.1
N$214: IC6.1(QB) R211.1
N$215: IC6.2(QC) R213.1
N$216: IC6.3(QD) R215.1
N$217: IC6.4(QE) R217.2
N$218: IC6.7(QH) R248.1
N$219: IC6.6(QG) R249.2
N$220: IC6.5(QF) R258.1
N$221: IC16.9(QH) IC17.10(SER)
N$222: IC16.13(C) R214.1 S22.4(P1)
N$223: R210.1 S24.4(P1)
N$224: IC16.11(A) S23.3(P)
N$226: IC16.4(F) S26.1(S)
N$227: IC18.6(H) R219.1 S20.4(P1)
N$228: IC16.12(B) R216.1 S21.4(P1)
N$229: R240.1 S6.2(S1)
N$230: IC16.14(D) S24.3(P)
N$231: IC9.7(Q2) R87.1
N$233: R201.1 S27.4(P1)
N$234: R235.1 R270.1 S2.A
N$235: R212.1 S23.4(P1)
N$236: IC9.5(Q1) R80.1
N$237: R74.2 R75.2 R78.2 R82.2
N$238: LED9.A R252.1
N$239: LED10.A R253.2
N$240: LED11.A R256.2
N$241: LED12.A R260.2
N$242: IC18.5(G) R220.1 S19.4(P1)
N$243: R74.1 R75.1 R76.1 R77.2 R81.1
N$244: R231.1 S16.2(S1)
N$245: IC16.6(H) R202.1 S14.3(P)
N$246: R263.1 S13.2(S1)
N$247: Q5.2(C) S4.C
N$248: IC17.6(H) S13.1(S)
N$249: IC18.3(E) R226.1 S17.4(P1)
N$251: IC17.3(E) S10.3(P)
N$252: LED16.A R267.2
N$253: IC17.11(A) S6.1(S)
N$254: IC18.11(A) S16.1(S)
N$255: IC16.3(E) S25.1(S)
N$256: R247.1 S8.4(P1)
N$258: LED3.A R241.2
N$259: LED4.A R242.2
N$260: LED5.A R243.1
N$261: LED15.A R266.1
N$263: LED8.A R251.2
N$264: LED13.A R261.2
N$266: IC4.9(QH*) IC5.14(SER)
N$267: IC6.14(SER) IC7.9(QH*)
N$268: IC6.9(QH*) IC8.14(SER)
N$269: LED17.A R268.2
N$270: LED18.A R238.1
N$271: LED19.A R239.1
N$272: LED20.A R245.1
N$273: LED21.A R246.2
N$274: LED22.A R248.2
N$275: LED23.A R249.1
N$276: LED24.A R258.2
N$277: LED25.A R265.2
N$278: LED26.A R264.2
N$279: LED27.A R203.2
N$280: LED28.A R229.2
N$281: LED29.A R228.1
N$282: LED30.A R227.2
N$283: LED31.A R223.2
N$284: LED32.A R222.1
N$285: LED33.A R221.2
N$286: LED34.A R217.1
N$287: LED35.A R215.2
N$288: LED36.A R213.2
N$289: LED37.A R211.2
N$290: LED38.A R208.2
N$291: LED39.A R205.2
N$292: LED40.A R204.1
N$294: D2.A IC1.3(A:O) IC3.9(RESET)
N$295: D5.C S4.P$4
N$297: D6.C S4.P$8
N$298: D7.C S3.P$1
N$299: D8.C S3.P$2
N$300: D9.C S3.P$4
N$301: D10.C S3.P$8
N$302: C11.+ Q8.3(E) R45.2
N$303: Q8.2(C) R36.1 S1.3
N$305: J1.1 S2.SW1
N$306: J2.1 R269.1 R270.2 S2.SW2
N$307: IC3.18(XTAL2) XTL1.3(B)
N$561: Q9.3(E) Q10.2(C) Q11.3(E) R47.2 R61.2 R71.1
N$582: C29.+ R112.1 R113.2 R114.1 R116.1
N$621: Q1.1(B) Q2.1(B) Q2.2(C) Q4.2(C)
N$622: J6.3 R137.2
N$623: IC15A.3 IC15B.1 R121.2 R122.1 R124.1
N$625: D30.C D31.A IC11.7(B:OUT) IC12.11(D:A) J6.1 R107.2 TM5.2(S) TM5.3(E)
NOTE0: IC3.21((A8)PC0) IC9.3(D0)
NOTE1: IC3.22((A9)PC1) IC9.14(D5)
NOTE2: IC3.23((A10)PC2) IC9.4(D1)
NOTE3: IC3.24((A11)PC3) IC9.13(D4)
NOTE4: IC3.25((A12)PC4) IC9.6(D2)
NOTE5: IC3.26((A13)PC5) IC9.11(D3)
NOTE_LATCH: IC3.29((OC1B)PE2) IC9.9(CLK)
Q17: C19.2 Q15.1(B) Q15.2(C) Q17.3(E)
ROTARY1: D3.A D7.A IC3.34((AD5)PA5)
ROTARY2: D4.A D8.A IC3.35((AD4)PA4)
ROTARY4: D5.A D9.A IC3.36((AD3)PA3)
ROTARY8: D6.A D10.A IC3.37((AD2)PA2)
ROTARYCOM3: IC3.33((AD6)PA6) R254.2 S3.C
SLIDE: IC3.27((A14)PC6) R59.1
SPI_CLK: IC2.6(SCK) IC3.8((SCK)PB7) IC4.11(SCK) IC5.11(SCK) IC6.11(SCK) IC7.11(SCK) IC8.11(SCK) IC16.2(CLK) IC17.2(CLK) IC18.2(CLK)
SPI_IN: IC2.5(SI) IC3.6((MOSI)PB5) IC4.14(SER)
SPI_OUT: IC1.8(C:O) IC2.2(SO) IC3.7((MISO)PB6)
SWITCH_LATCH: IC1.10(C:OE) IC2.1(CS/) IC3.1((T0)PB0) IC16.1(SH/LD\) IC17.1(SH/LD\) IC18.1(SH/LD\)
TEMPO_SW: IC18.13(C) J1.2 R233.1
TEMPO_SW_A: C100.2 IC3.38((AD1)PA1) R235.2
TEMPO_SW_B: C101.2 IC3.39((AD0)PA0) R236.2
USB_TX: IC3.4((TXD1)PB3) J3.2
USBRX: IC3.3((RXD1)PB2) J3.1
XTL1: IC3.19(XTAL1) XTL1.1(E)
Unconnected: IC1.6(B:O) IC1.11(D:O) IC3.2((T1)PB1) IC3.5((SS)PB4) IC3.12((INT0)PD2) IC3.13((INT1)PD3) IC3.31((INT2)PE0) IC8.9(QH*) IC16.7(QH\) IC17.7(QH\) IC18.7(QH\) S5.1(S) S5.3(P) S6.4(P1) S7.2(S1) S7.4(P1) S8.2(S1) S9.2(S1) S9.4(P1) S10.2(S1) S11.2(S1) S12.2(S1) S12.3(P) S13.3(P) S14.1(S) S14.4(P1) S15.2(S1) S15.3(P) S16.3(P) S17.1(S) S17.3(P) S18.1(S) S18.3(P) S19.3(P) S20.1(S) S20.3(P) S21.1(S) S21.3(P) S22.3(P) S24.1(S) S25.3(P) S26.3(P) S27.1(S)

## Buses
SLIDE,ACCENT,NOTE[0..5]

## Notes on the sheet
- x0xb0x Mainboard Beta Release (3/8/2005)
- Copyright (c) 2005, Limor Fried.
- See licensing information at http://www.ladyada.net/make/x0xb0x/
- Rotary Encoders | tempo
- function select | bank select
- Tact Switches
- LEDs
- WAVEFORM
- VCO
- TUNING
- VCA
- CUTOFF FREQ.
- RESONANCE
- ENV. MOD
- ENV
- ENV. DECAY
- ACCENT
- HEADPHONE
- MIXER
- VOLUME

## Library data of the parts
C10 C18-C21 C24-C27 C33-C36 C41 C45-C47 C54 C100 C101 C103 C104 C106-C113 = rcl:C-US: CAPACITOR, American symbol
C11 C13-C17 C22 C23 C28-C32 C37 C38 C40 C42-C44 C48-C53 C55 C56 C58 C59 C62 C72 C102 C105 = rcl:CPOL-US: POLARIZED CAPACITOR, American symbol
D1-D10 D24-D37 = diode:1N4148: DIODE high speed (Philips)
IC1 = 74xx-us:74*126: Quad bus BUFFER, 3-state
IC2 = atmel:AT25*: SPI bus serial EEPROM
IC3 = 303parts:MEGA162*P: MICROCONTROLLER 16 Kbytes FLASH, 512 bytes EEPROM 1 Kbytes SRAM dual UART hardware multiplier
IC4-IC8 = 74xx-eu:74*595: 8-bit SHIFT REGISTER, output latch
IC9 = 41xx:4174: 41xx DEVICE
IC11 = 303parts:AN6562: OP AMP
IC12 = 40xx:4066: Quad bilateral ANALOG SWITCH
IC14 = 303parts:LA44140
IC15A = 303parts:BA662
IC15B = 303parts:BA6110
IC16-IC18 = 74xx-eu:74*165: 8-bit parallel load SHIFT REGISTER
J1 J2 = jumper:J: Bridge
J3 = con-lstb:MA12-1: PIN HEADER
J4-J7 = con-lstb:MA03-1: PIN HEADER
LED1-LED40 = led:LED: LED OSRAM: - CHIPLED LG R971, LG N971, LY N971, LG Q971, LY Q971, LO R971, LY R971 LH N974, LH R974 LS Q976, LO Q976, LY Q976 LO Q996 - Hyper CHIPLED LW Q18S LB Q993, LB Q99A, LB R99A - SideLED LS A670, LO A670, LY A670, LG A670, LP A670 LB A673, LV A673, LT A673, LW A673 LH A674 LY A675 LS A676, LA A676, LO A676, LY A676, LW A676 LS A679, LY A679, LG A679 - Hyper Micro SIDELED® LS Y876, LA Y876, LO Y876, LY Y876 LT Y87S - SmartLED LW L88C, LW L88S LB L89C, LB L89S, LG L890 LS L89K, LO L89K, LY L89K LS L896, LA L896, LO L896, LY L896 - TOPLED LS T670, LO T670, LY T670, LG T670, LP T670 LSG T670, LSP T670, LSY T670, LOP T670, LYG T670 LG T671, LOG T671, LSG T671 LB T673, LV T673, LT T673, LW T673 LH T674 LS T676, LA T676, LO T676, LY T676, LB T676, LH T676, LSB T676, LW T676 LB T67C, LV T67C, LT T67C, LS T67K, LO T67K, LY T67K, LW E67C LS E67B, LA E67B, LO E67B, LY E67B, LB E67C, LV E67C, LT E67C LW T67C LS T679, LY T679, LG T679 LS T770, LO T770, LY T770, LG T770, LP T770 LB T773, LV T773, LT T773, LW T773 LH T774 LS E675, LA E675, LY E675, LS T675 LS T776, LA T776, LO T776, LY T776, LB T776 LHGB T686 LT T68C, LB T68C - Hyper Mini TOPLED® LB M676 - Mini TOPLED Santana® LG M470 LS M47K, LO M47K, LY M47K Source: http://www.osram.convergy.de/
Q1 Q2 Q8-Q10 Q27 Q31 Q33 Q36 Q38 = 303parts:2SA733P
Q3-Q5 Q11 Q13-Q20 Q23-Q25 Q29 Q30 Q32 Q34 Q35 Q37 Q40 Q41 = 303parts:2SC536F
Q12 Q21 Q26 = 303parts:2SC1583
Q22 = 303parts:2SC2291
Q28 Q39 = 303parts:2SK30: N-Channel Junction FET
R34-R36 R45-R47 R59-R99 R101-R146 R148-R162 R165 R200-R270 = rcl:R-US_: RESISTOR, American symbol
R100A R100B = varistor:THERMISTOR: THERMISTOR
S1 = 303parts:SWITCH_GND
S2 = 303parts:PEC11-S
S3 S4 = 303parts:GH3074
S5-S27 = switch-omron:40-XX: OMRON SWITCH
TM3-TM5 = 303parts:TRIM_US-: POTENTIOMETER
VR2 VR3 VR5 VR7 VR8 = 303parts:POT
VR4 VR6 = 303parts:DUAL
XTL1 = 303parts:2SC2021R